# EAGLE design bug1 (EAGLE 9.0.1)
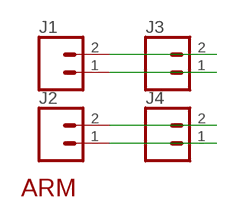
[diagram p0: schematic, sheet 1]

## Parts
J1  CONN_02LOCK  [1X02_LOCK]
J2  CONN_02LOCK  [1X02_LOCK]
J3  CONN_02LOCK  [1X02_LOCK]
J4  CONN_02LOCK  [1X02_LOCK]
U$1  ARMBUG1  [BUG1]

## Nets
V1: J1.1 J3.1
V2: J1.2 J3.2
V3: J2.1 J4.1
V4: J2.2 J4.2

## Library data of the parts
J1-J4 = SparkFun-Connectors:CONN_02: Multi connection point. Often used as Generic Header-pin footprint for 0.1 inch spaced/style header connections On any of the 0.1 inch spaced packages, you can populate with these: Break Away Headers - Straight <https://www.sparkfun.com/products/116> (PRT-00116) Break Away Male Headers - Right Angle <https://www.sparkfun.com/products/553> (PRT-00553) Female Headers <https://www.sparkfun.com/products/115> (PRT-00115) Break Away Headers - Machine Pin <https://www.sparkfun.com/products/117> (PRT-00117) Break Away Female Headers - Swiss Machine Pin <https://www.sparkfun.com/products/743> (PRT-00743) For SCREWTERMINALS and SPRING TERMINALS visit here: Screw Terimnals on SparkFun.com <https://www.sparkfun.com/search/results?term=Screw+Terminals> (5mm/3.5mm/2.54mm spacing) This device is also useful as a general connection point to wire up your design to another part of your project. Our various solder wires solder well into these plated through hole pads. Hook-Up Wire - Assortment (Stranded, 22 AWG) <https://www.sparkfun.com/products/11375> (PRT-11375) Hook-Up Wire - Assortment (Solid Core, 22 AWG) <https://www.sparkfun.com/products/11367> (PRT-11367) View the entire wire category on our website here <https://www.sparkfun.com/categories/141> Special notes: Molex polarized connector foot print use with: PRT-08233 with associated crimp pins and housings. 2.54_SCREWTERM for use with PRT-10571. 3.5mm Screw Terminal footprints for PRT-08084 5mm Screw Terminal footprints for use with PRT-08432
U$1 = arms:ARM

## Board
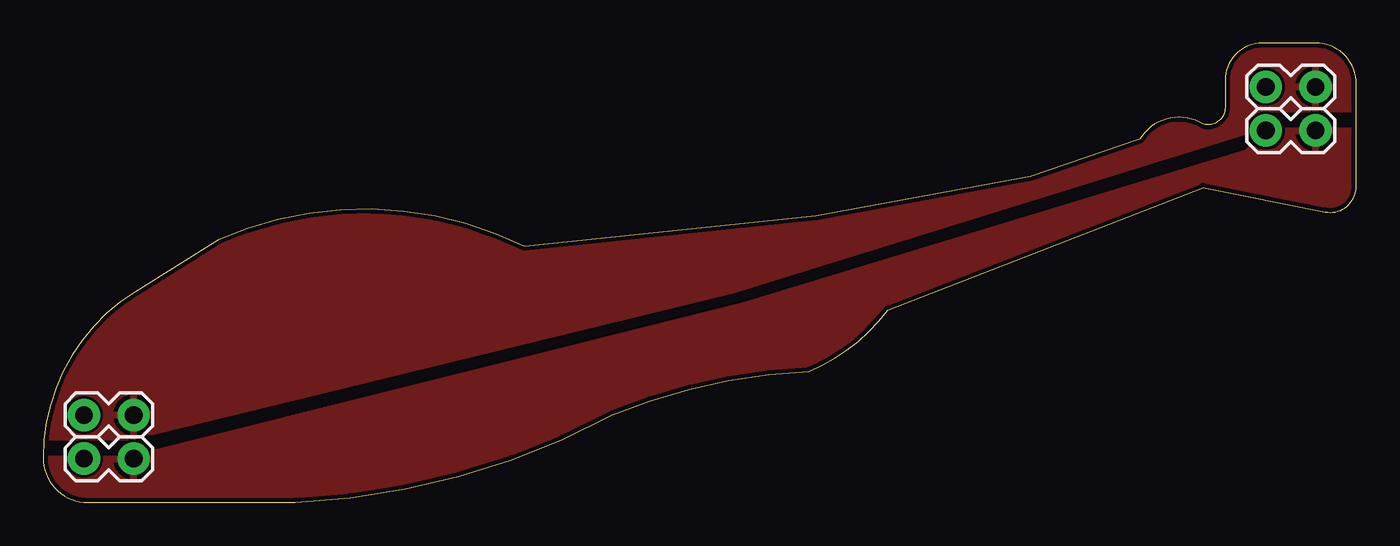
[diagram p1: board, top side]
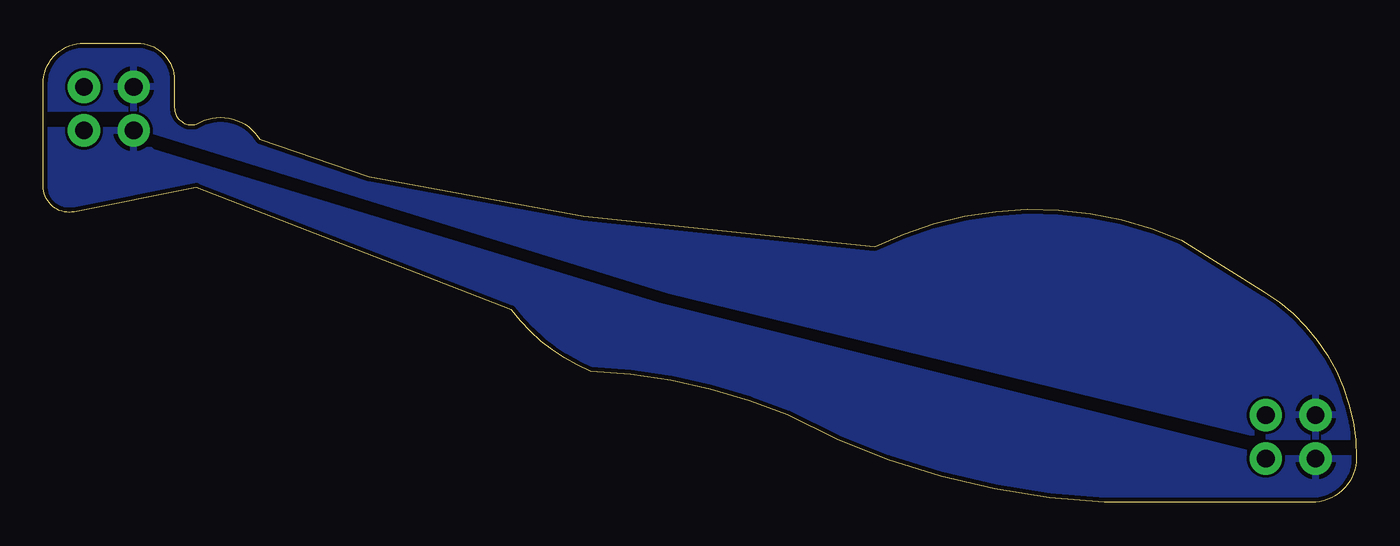
[diagram p2: board, bottom side, seen from below]

Size 76.2 x 26.67 mm. Coordinates in mm from the lower left corner, seen from the top.
Outline: 10.16,15.24 5.33,12.22 arc58 0,2.6 arc90 2.6,0 11.43,0 arc30 33.02,5.08 arc-20 44.45,7.62 arc30 49.02,11.18 67.31,18.29 74.38,16.87 arc101 76.2,18.36 76.2,24.29 arc90 73.82,26.67 70.73,26.67 arc90 68.58,24.52 68.58,22.92 arc-107 67.31,21.97 arc90 63.63,21.08 57.28,18.92 44.83,16.64 27.94,14.86 arc50 10.16,15.24
Copper layers (1*16): Top 0.035mm / dielectric 1.5mm / Bottom 0.035mm
Design rules "default *": minimum track width 6mil, minimum drill 0.35mm, track to track 6mil, track to pad 6mil, pad to pad 6mil, via to via 6mil, smd to smd 6mil, copper to edge 10mil, drill to drill 6mil, minimum pad ring 10mil, minimum via ring 8mil, stop-mask expansion 4mil, vias tented up to drill 0mil, thermal gap 10mil

### Footprints (pad centres in the part's own frame; a part is rotated, then mirrored left to right if it is on the bottom)
1X02_LOCK = drill 1.016 pad 1.88: 1 -0.178,0; 2 2.718,0

### Placement (x,y rotation side)
J1  71.12,24.13 0 top
J2  71.12,21.59 0 top
J3  2.54,5.08 0 top
J4  2.54,2.54 0 top
U$1  11.43,1.27 0 top

### Tracks (layer width: path | path; a pad name or v marks a point on that pad's centre or on a via)
V1
  pour Bottom: 0,27.94 0,3.81 5.08,3.81 39.88,12.32 69.85,21.59 71.12,22.86 77.47,22.86 77.47,27.94
V2
  pour Top: 0,27.94 0,3.81 5.08,3.81 39.88,12.32 69.85,21.59 71.12,22.86 77.47,22.86 77.47,27.94
V3
  pour Bottom: 0,0 0,2.54 5.08,2.54 40.64,11.43 69.85,20.32 71.12,21.59 73.66,21.59 77.47,21.59 77.47,0
V4
  pour Top: 0,0 0,2.54 5.08,2.54 40.64,11.43 69.85,20.32 71.12,21.59 73.66,21.59 77.47,21.59 77.47,0

### Text on the board
tStop: by / @securelyfitz / git.io/sao-arms